# Altium schematic sheet EP2C5T144C8.SchDoc
size A3
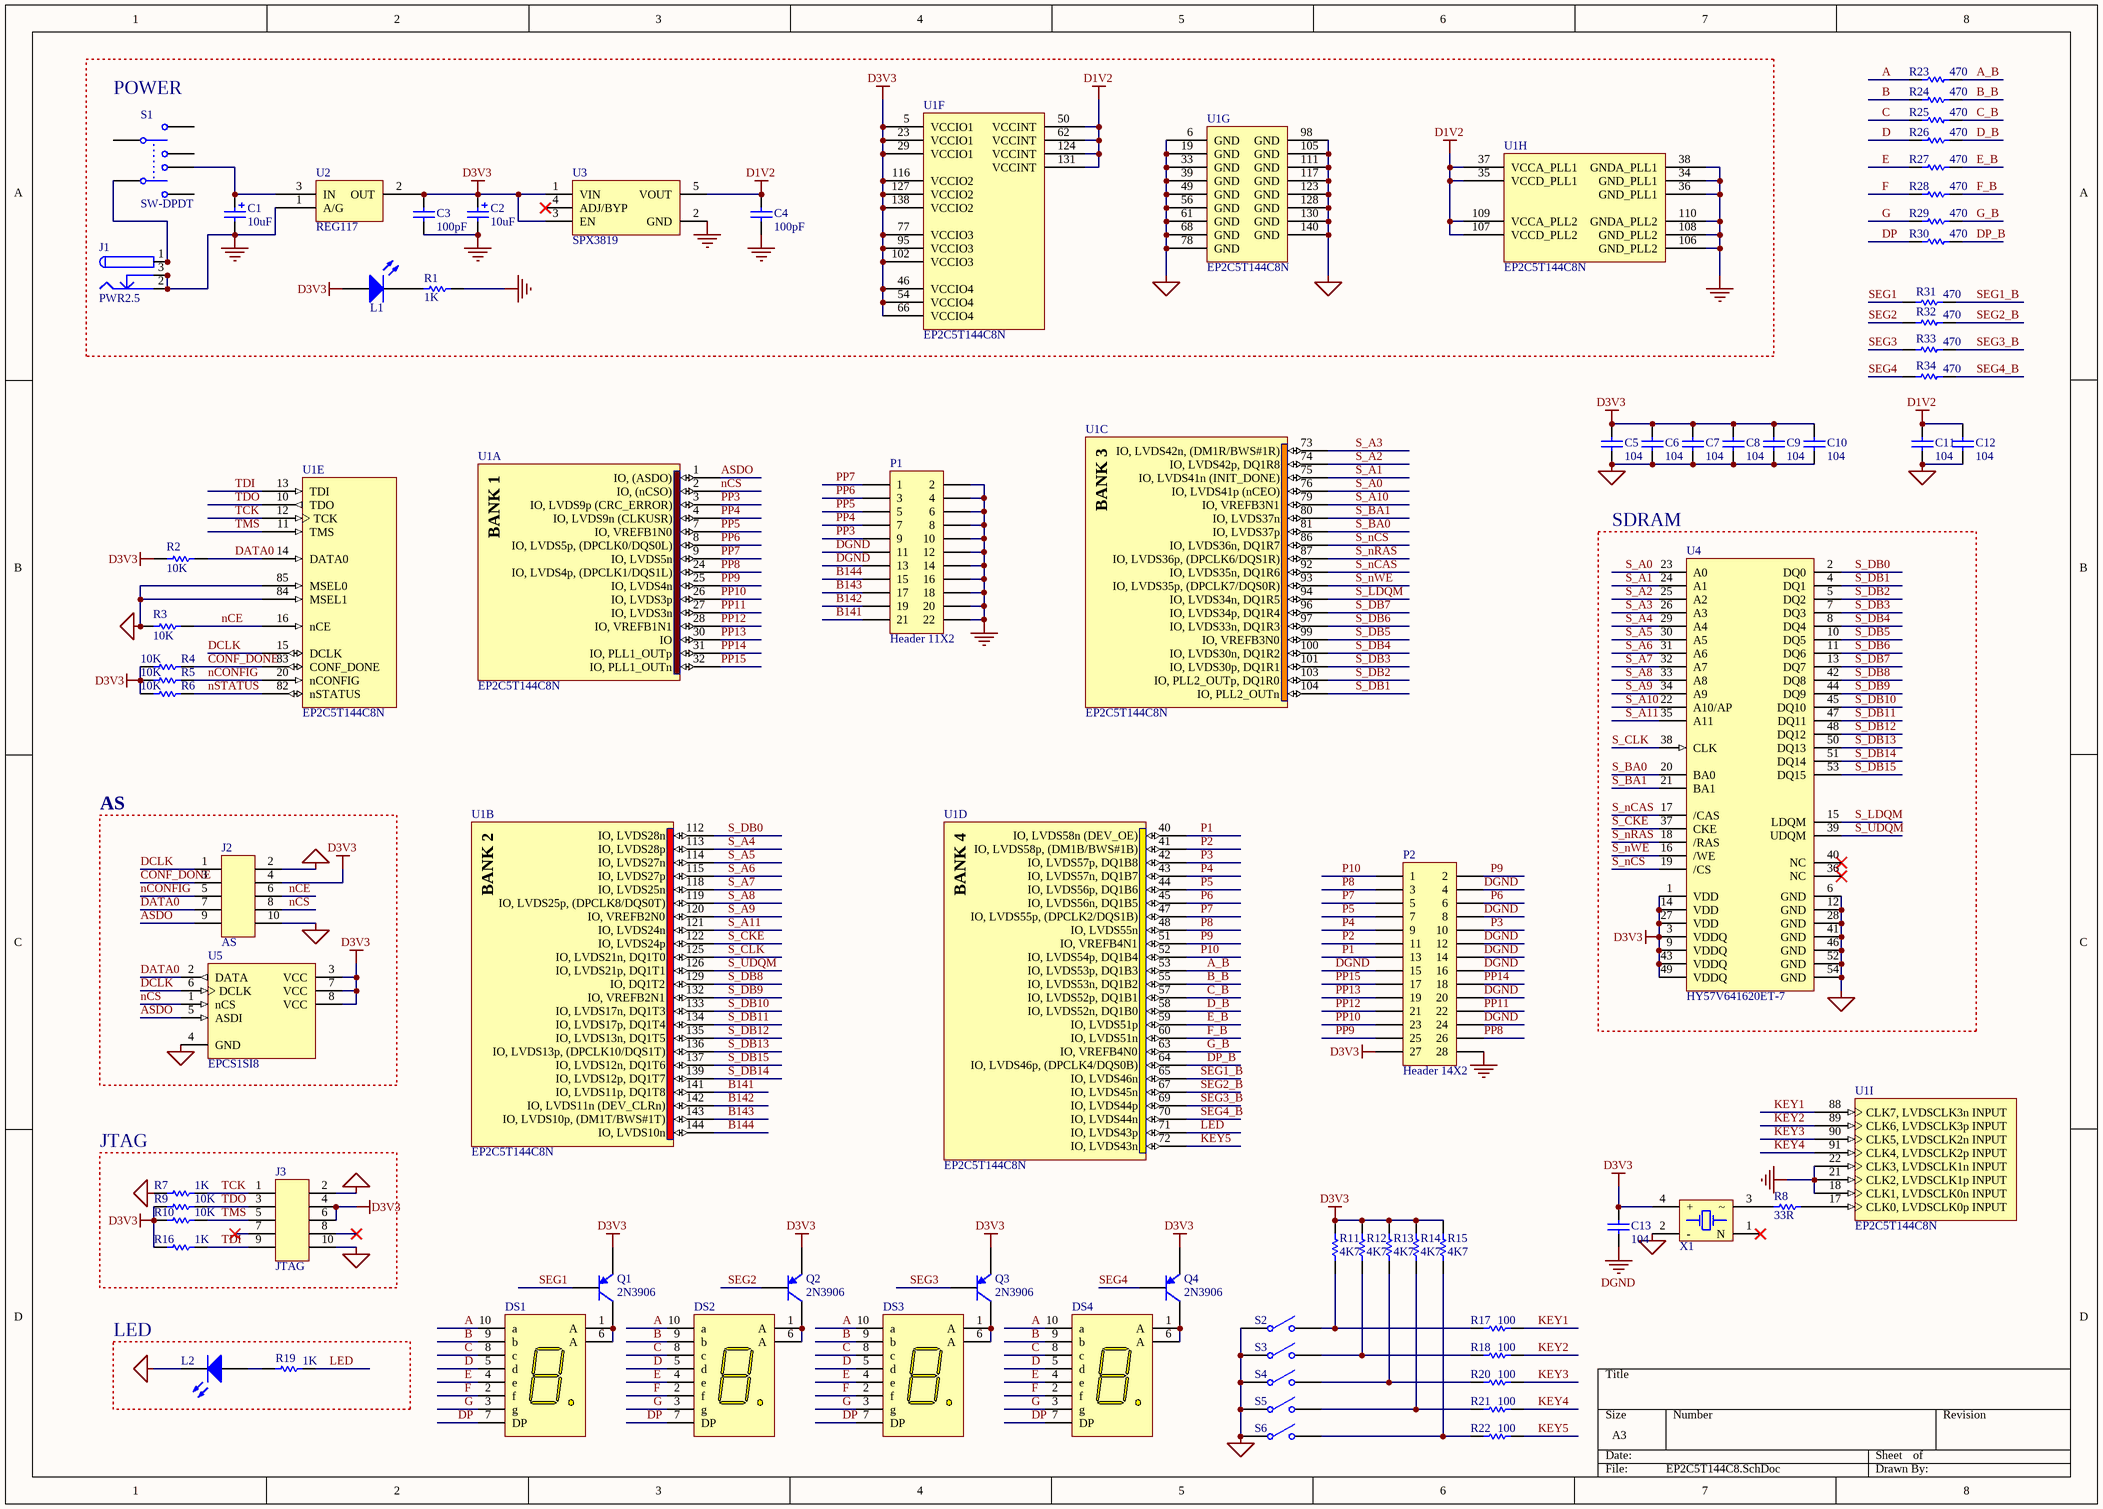
[diagram p0: EP2C5T144C8.SchDoc]

## Parts
C1  value 10uF  [tanCap]  (hidden comment: Cap Pol3)
C2  value 10uF  [tanCap]  (hidden comment: Cap Pol3)
C3  value 100pF  [CC2012-0805]  (hidden comment: Cap Semi)
C4  value 100pF  [CC2012-0805]  (hidden comment: Cap Semi)
C5  value 104  [CC2012-0805]  (hidden comment: Cap Semi)
C6  value 104  [CC2012-0805]  (hidden comment: Cap Semi)
C7  value 104  [CC2012-0805]  (hidden comment: Cap Semi)
C8  value 104  [CC2012-0805]  (hidden comment: Cap Semi)
C9  value 104  [CC2012-0805]  (hidden comment: Cap Semi)
C10  value 104  [CC2012-0805]  (hidden comment: Cap Semi)
C11  value 104  [CC2012-0805]  (hidden comment: Cap Semi)
C12  value 104  [CC2012-0805]  (hidden comment: Cap Semi)
C13  value 104  [CC2012-0805]  (hidden comment: Cap)
DS1  Dpy Yellow-CA  [LEDDIP-10]  (value not drawn)
DS2  Dpy Yellow-CA  [LEDDIP-10]  (value not drawn)
DS3  Dpy Yellow-CA  [LEDDIP-10]  (value not drawn)
DS4  Dpy Yellow-CA  [LEDDIP-10]  (value not drawn)
J1  PWR2.5  [KLD-0202]
J2  AS  [JATG_XU]
J3  JTAG  [JATG_XU]
L1  LED-3MM  [CC2012-0805]  (value not drawn)
L2  LED-3MM  [CC2012-0805]  (value not drawn)
P1  Header 11X2  [HDR2X11]
P2  Header 14X2  [HDR2X14]
Q1  2N3906  [SOT-23]
Q2  2N3906  [SOT-23]
Q3  2N3906  [SOT-23]
Q4  2N3906  [SOT-23]
R1  value 1K  [CR2012-0805]  (hidden comment: Res1)
R2  value 10K  [CR2012-0805]  (hidden comment: Res Semi)
R3  value 10K  [CR2012-0805]  (hidden comment: Res1)
R4  value 10K  [CR2012-0805]  (hidden comment: Res1)
R5  value 10K  [CR2012-0805]  (hidden comment: Res1)
R6  value 10K  [CR2012-0805]  (hidden comment: Res1)
R7  value 1K  [CR2012-0805]  (hidden comment: Res1)
R8  value 33R  [CR2012-0805]  (hidden comment: Res1)
R9  value 10K  [CR2012-0805]  (hidden comment: Res1)
R10  value 10K  [CR2012-0805]  (hidden comment: Res1)
R11  value 4K7  [CR2012-0805]  (hidden comment: Res1)
R12  value 4K7  [CR2012-0805]  (hidden comment: Res1)
R13  value 4K7  [CR2012-0805]  (hidden comment: Res1)
R14  value 4K7  [CR2012-0805]  (hidden comment: Res1)
R15  value 4K7  [CR2012-0805]  (hidden comment: Res1)
R16  value 1K  [CR2012-0805]  (hidden comment: Res1)
R17  value 100  [CR2012-0805]  (hidden comment: Res1)
R18  value 100  [CR2012-0805]  (hidden comment: Res1)
R19  value 1K  [CR2012-0805]  (hidden comment: Res1)
R20  value 100  [CR2012-0805]  (hidden comment: Res1)
R21  value 100  [CR2012-0805]  (hidden comment: Res1)
R22  value 100  [CR2012-0805]  (hidden comment: Res1)
R23  value 470  [CR2012-0805]  (hidden comment: Res1)
R24  value 470  [CR2012-0805]  (hidden comment: Res1)
R25  value 470  [CR2012-0805]  (hidden comment: Res1)
R26  value 470  [CR2012-0805]  (hidden comment: Res1)
R27  value 470  [CR2012-0805]  (hidden comment: Res1)
R28  value 470  [CR2012-0805]  (hidden comment: Res1)
R29  value 470  [CR2012-0805]  (hidden comment: Res1)
R30  value 470  [CR2012-0805]  (hidden comment: Res1)
R31  value 470  [CR2012-0805]  (hidden comment: Res1)
R32  value 470  [CR2012-0805]  (hidden comment: Res1)
R33  value 470  [CR2012-0805]  (hidden comment: Res1)
R34  value 470  [CR2012-0805]  (hidden comment: Res1)
S1  SW-DPDT  [DPDT-6]
S2  SW-SPST  [SW2]  (value not drawn)
S3  SW-SPST  [SW2]  (value not drawn)
S4  SW-SPST  [SW2]  (value not drawn)
S5  SW-SPST  [SW2]  (value not drawn)
S6  SW-SPST  [SW2]  (value not drawn)
U1  EP2C5T144C8N  [TQFP144_N]  (parts A,B,C,D,E,F,G,H,I of 9)
U2  REG117  [SOT223]
U3  SPX3819  [SO-G5/P.95]
U4  HY57V641620ET-7  [TSOP-54]
U5  EPCS1SI8  [SOIC8]
X1  XTAL-S  [DSO-N4]  (value not drawn)

## Blocks framed on the sheet
POWER: C1-C4 J1 L1 R1 S1 U1-U3
SDRAM: U4
AS: J2 U5
JTAG: J3 R7 R9 R10 R16
LED: L2 R19

## Nets
D1V2: C4.2 C11.2 C12.2 U1.35(VCCD_PLL1) U1.37(VCCA_PLL1) U1.50(VCCINT) U1.62(VCCINT) U1.107(VCCD_PLL2) U1.109(VCCA_PLL2) U1.124(VCCINT) U1.131(VCCINT) U3.5(VOUT)
D3V3: C2.1 C3.2 C5.2 C6.2 C7.2 C8.2 C9.2 C10.2 C13.2 J2.4 J3.4 J3.6 L1.1(A) P2.27 Q1.1(E) Q2.1(E) Q3.1(E) Q4.1(E) R2.2 R4.2 R5.2 R6.2 R9.2 R10.2 R11.1 R12.1 R13.1 R14.1 R15.1 R16.2 U1.5(VCCIO1) U1.23(VCCIO1) U1.29(VCCIO1) U1.46(VCCIO4) U1.54(VCCIO4) U1.66(VCCIO4) U1.77(VCCIO3) U1.95(VCCIO3) U1.102(VCCIO3) U1.116(VCCIO2) U1.127(VCCIO2) U1.138(VCCIO2) U2.2(OUT) U3.1(VIN) U3.3(EN) U4.1(VDD) U4.3(VDDQ) U4.9(VDDQ) U4.14(VDD) U4.27(VDD) U4.43(VDDQ) U4.49(VDDQ) U5.3(VCC) U5.7(VCC) U5.8(VCC) X1.4(+)
DGND: C1.2 C2.2 C3.1 C4.1 C5.1 C6.1 C7.1 C8.1 C9.1 C10.1 C11.1 C12.1 C13.1 J1.2 J1.2A J1.2B J1.3 J1.3A J1.3B J2.2 J2.10 J3.2 J3.10 L2.2(K) P1.2 P1.4 P1.6 P1.8 P1.10 P1.11 P1.12 P1.13 P1.14 P1.16 P1.18 P1.20 P1.22 P2.4 P2.8 P2.12 P2.14 P2.15 P2.16 P2.20 P2.24 P2.28 R1.1 R3.2 R7.2 S2.1(COMMON) S3.1(COMMON) S4.1(COMMON) S5.1(COMMON) S6.1(COMMON) U1.6(GND) U1.18(CLK1,_LVDSCLK0n_INPUT) U1.19(GND) U1.21(CLK2,_LVDSCLK1p_INPUT) U1.22(CLK3,_LVDSCLK1n_INPUT) U1.33(GND) U1.34(GND_PLL1) U1.36(GND_PLL1) U1.38(GNDA_PLL1) U1.39(GND) U1.49(GND) U1.56(GND) U1.61(GND) U1.68(GND) U1.78(GND) U1.84(MSEL1) U1.85(MSEL0) U1.98(GND) U1.105(GND) U1.106(GND_PLL2) U1.108(GND_PLL2) U1.110(GNDA_PLL2) U1.111(GND) U1.117(GND) U1.123(GND) U1.128(GND) U1.130(GND) U1.140(GND) U2.1(A/G) U3.2(GND) U4.6(GND) U4.12(GND) U4.28(GND) U4.41(GND) U4.46(GND) U4.52(GND) U4.54(GND) U5.4(GND) X1.2(-)
A: DS1.10(a) DS2.10(a) DS3.10(a) DS4.10(a) R23.2
A_B: R23.1 U1.53(IO,_LVDS53p,_DQ1B3)
ASDO: J2.9 U1.1(IO,_(ASDO)) U5.5(ASDI)
B: DS1.9(b) DS2.9(b) DS3.9(b) DS4.9(b) R24.2
B141: P1.21 U1.141(IO,_LVDS11p,_DQ1T8)
B142: P1.19 U1.142(IO,_LVDS11n_(DEV_CLRn))
B143: P1.17 U1.143(IO,_LVDS10p,_(DM1T/BWS#1T))
B144: P1.15 U1.144(IO,_LVDS10n)
B_B: R24.1 U1.55(IO,_LVDS53n,_DQ1B2)
C: DS1.8(c) DS2.8(c) DS3.8(c) DS4.8(c) R25.2
C_B: R25.1 U1.57(IO,_LVDS52p,_DQ1B1)
CONF_DONE: J2.3 R4.1 U1.83(CONF_DONE)
D: DS1.5(d) DS2.5(d) DS3.5(d) DS4.5(d) R26.2
D_B: R26.1 U1.58(IO,_LVDS52n,_DQ1B0)
DATA0: J2.7 R2.1 U1.14(DATA0) U5.2(DATA)
DCLK: J2.1 U1.15(DCLK) U5.6(DCLK)
DP: DS1.7(DP) DS2.7(DP) DS3.7(DP) DS4.7(DP) R30.2
DP_B: R30.1 U1.64(IO,_LVDS46p,_(DPCLK4/DQS0B))
E: DS1.4(e) DS2.4(e) DS3.4(e) DS4.4(e) R27.2
E_B: R27.1 U1.59(IO,_LVDS51p)
F: DS1.2(f) DS2.2(f) DS3.2(f) DS4.2(f) R28.2
F_B: R28.1 U1.60(IO,_LVDS51n)
G: DS1.3(g) DS2.3(g) DS3.3(g) DS4.3(g) R29.2
G_B: R29.1 U1.63(IO,_VREFB4N0)
KEY1: R17.1 U1.88(CLK7,_LVDSCLK3n_INPUT)
KEY2: R18.1 U1.89(CLK6,_LVDSCLK3p_INPUT)
KEY3: R20.1 U1.90(CLK5,_LVDSCLK2n_INPUT)
KEY4: R21.1 U1.91(CLK4,_LVDSCLK2p_INPUT)
KEY5: R22.1 U1.72(IO,_LVDS43n)
LED: R19.1 U1.71(IO,_LVDS43p)
nCE: J2.6 R3.1 U1.16(nCE)
nCONFIG: J2.5 R5.1 U1.20(nCONFIG)
nCS: J2.8 U1.2(IO,_(nCSO)) U5.1(nCS)
nSTATUS: R6.1 U1.82(nSTATUS)
P1: P2.13 U1.40(IO,_LVDS58n_(DEV_OE))
P2: P2.11 U1.41(IO,_LVDS58p,_(DM1B/BWS#1B))
P3: P2.10 U1.42(IO,_LVDS57p,_DQ1B8)
P4: P2.9 U1.43(IO,_LVDS57n,_DQ1B7)
P5: P2.7 U1.44(IO,_LVDS56p,_DQ1B6)
P6: P2.6 U1.45(IO,_LVDS56n,_DQ1B5)
P7: P2.5 U1.47(IO,_LVDS55p,_(DPCLK2/DQS1B))
P8: P2.3 U1.48(IO,_LVDS55n)
P9: P2.2 U1.51(IO,_VREFB4N1)
P10: P2.1 U1.52(IO,_LVDS54p,_DQ1B4)
PP3: P1.9 U1.3(IO,_LVDS9p_(CRC_ERROR))
PP4: P1.7 U1.4(IO,_LVDS9n_(CLKUSR))
PP5: P1.5 U1.7(IO,_VREFB1N0)
PP6: P1.3 U1.8(IO,_LVDS5p,_(DPCLK0/DQS0L))
PP7: P1.1 U1.9(IO,_LVDS5n)
PP8: P2.26 U1.24(IO,_LVDS4p,_(DPCLK1/DQS1L))
PP9: P2.25 U1.25(IO,_LVDS4n)
PP10: P2.23 U1.26(IO,_LVDS3p)
PP11: P2.22 U1.27(IO,_LVDS3n)
PP12: P2.21 U1.28(IO,_VREFB1N1)
PP13: P2.19 U1.30(IO)
PP14: P2.18 U1.31(IO,_PLL1_OUTp)
PP15: P2.17 U1.32(IO,_PLL1_OUTn)
S_A0: U1.76(IO,_LVDS41p_(nCEO)) U4.23(A0)
S_A1: U1.75(IO,_LVDS41n_(INIT_DONE)) U4.24(A1)
S_A2: U1.74(IO,_LVDS42p,_DQ1R8) U4.25(A2)
S_A3: U1.73(IO,_LVDS42n,_(DM1R/BWS#1R)) U4.26(A3)
S_A4: U1.113(IO,_LVDS28p) U4.29(A4)
S_A5: U1.114(IO,_LVDS27n) U4.30(A5)
S_A6: U1.115(IO,_LVDS27p) U4.31(A6)
S_A7: U1.118(IO,_LVDS25n) U4.32(A7)
S_A8: U1.119(IO,_LVDS25p,_(DPCLK8/DQS0T)) U4.33(A8)
S_A9: U1.120(IO,_VREFB2N0) U4.34(A9)
S_A10: U1.79(IO,_VREFB3N1) U4.22(A10/AP)
S_A11: U1.121(IO,_LVDS24n) U4.35(A11)
S_BA0: U1.81(IO,_LVDS37p) U4.20(BA0)
S_BA1: U1.80(IO,_LVDS37n) U4.21(BA1)
S_CKE: U1.122(IO,_LVDS24p) U4.37(CKE)
S_CLK: U1.125(IO,_LVDS21n,_DQ1T0) U4.38(CLK)
S_DB0: U1.112(IO,_LVDS28n) U4.2(DQ0)
S_DB1: U1.104(IO,_PLL2_OUTn) U4.4(DQ1)
S_DB2: U1.103(IO,_PLL2_OUTp,_DQ1R0) U4.5(DQ2)
S_DB3: U1.101(IO,_LVDS30p,_DQ1R1) U4.7(DQ3)
S_DB4: U1.100(IO,_LVDS30n,_DQ1R2) U4.8(DQ4)
S_DB5: U1.99(IO,_VREFB3N0) U4.10(DQ5)
S_DB6: U1.97(IO,_LVDS33n,_DQ1R3) U4.11(DQ6)
S_DB7: U1.96(IO,_LVDS34p,_DQ1R4) U4.13(DQ7)
S_DB8: U1.129(IO,_DQ1T2) U4.42(DQ8)
S_DB9: U1.132(IO,_VREFB2N1) U4.44(DQ9)
S_DB10: U1.133(IO,_LVDS17n,_DQ1T3) U4.45(DQ10)
S_DB11: U1.134(IO,_LVDS17p,_DQ1T4) U4.47(DQ11)
S_DB12: U1.135(IO,_LVDS13n,_DQ1T5) U4.48(DQ12)
S_DB13: U1.136(IO,_LVDS13p,_(DPCLK10/DQS1T)) U4.50(DQ13)
S_DB14: U1.139(IO,_LVDS12p,_DQ1T7) U4.51(DQ14)
S_DB15: U1.137(IO,_LVDS12n,_DQ1T6) U4.53(DQ15)
S_LDQM: U1.94(IO,_LVDS34n,_DQ1R5) U4.15(LDQM)
S_nCAS: U1.92(IO,_LVDS35n,_DQ1R6) U4.17(/CAS)
S_nCS: U1.86(IO,_LVDS36n,_DQ1R7) U4.19(/CS)
S_nRAS: U1.87(IO,_LVDS36p,_(DPCLK6/DQS1R)) U4.18(/RAS)
S_nWE: U1.93(IO,_LVDS35p,_(DPCLK7/DQS0R)) U4.16(/WE)
S_UDQM: U1.126(IO,_LVDS21p,_DQ1T1) U4.39(UDQM)
SEG1: Q1.2(B) R31.2
SEG1_B: R31.1 U1.65(IO,_LVDS46n)
SEG2: Q2.2(B) R32.2
SEG2_B: R32.1 U1.67(IO,_LVDS45n)
SEG3: Q3.2(B) R33.2
SEG3_B: R33.1 U1.69(IO,_LVDS44p)
SEG4: Q4.2(B) R34.2
SEG4_B: R34.1 U1.70(IO,_LVDS44n)
TCK: J3.1 R7.1 U1.12(TCK)
TDI: J3.9 R16.1 U1.13(TDI)
TDO: J3.3 R9.1 U1.10(TDO)
TMS: J3.5 R10.1 U1.11(TMS)
NetC1_1: C1.1 S1.5 U2.3(IN)
NetDS1_1: DS1.1(A) DS1.6(A) Q1.3(C)
NetDS2_1: DS2.1(A) DS2.6(A) Q2.3(C)
NetDS3_1: DS3.1(A) DS3.6(A) Q3.3(C)
NetDS4_1: DS4.1(A) DS4.6(A) Q4.3(C)
NetJ1_1: J1.1 J1.1A J1.1B S1.4
NetL1_2: L1.2(K) R1.2
NetL2_1: L2.1(A) R19.2
NetR8_1: R8.1 U1.17(CLK0,_LVDSCLK0p_INPUT)
NetR8_2: R8.2 X1.3
NetR11_2: R11.2 R17.2 S2.2(NO)
NetR12_2: R12.2 R18.2 S3.2(NO)
NetR13_2: R13.2 R20.2 S4.2(NO)
NetR14_2: R14.2 R21.2 S5.2(NO)
NetR15_2: R15.2 R22.2 S6.2(NO)

Not connected (* = marked no-connect by the designer): J3 7* 8*; S1 1 2 3 6; U3 4(ADJ/BYP)*; U4 36(NC)* 40(NC)*; X1 1(N)*

## Notes on the sheet
- (in symbol EP2C5T144C8N, part A) BANK 1
- (in symbol EP2C5T144C8N, part B) BANK 2
- (in symbol EP2C5T144C8N, part C) BANK 3
- (in symbol EP2C5T144C8N, part D) BANK 4

## Library data of the parts
C1 C2 = Cap Pol3: Polarized Capacitor (Surface Mount); Published: 8-Jun-2000; Revision: July-2002: Re-released for DXP Platform.; Publisher: Altium Limited
C3-C12 = Cap Semi: Capacitor (Semiconductor SIM Model); Published: 8-Jun-2000; Revision: July-2002: Re-released for DXP Platform.; Publisher: Altium Limited
C13 = Cap: Capacitor; Published: 8-Jun-2000; Revision: July-2002: Re-released for DXP Platform.; Publisher: Altium Limited
DS1-DS4 = Dpy Yellow-CA: 7.6 mm Micro Bright Yellow 7-Segment Display: CA, RH DP; MinimumIntensity: 225 ucd; Note: IF = 5 mA; Note: Pins 1 and 6 are redundant Anodes.; Published: 8-Jun-2000; LatestRevisionDate: 17-Dec-2003; LatestRevisionNote: Schematic revised, PCB Footprint replaced.; DatasheetDocument: 11-Feb-2002; PackageDocument: 19-Feb-2002; PackageReference: LEDDIP-10; Publisher: Altium Limited; Colour: Yellow; ComponentLink1Description: Manufacturer Link; ComponentLink1URL: http://www.agilent.com/
J1 = PWR2.5: Low Voltage Power Supply Connector; Published: 17-Dec-2003; DatasheetDocument: 09-May-2002; Publisher: Altium Limited; ComponentLink1Description: Manufacturer Link; ComponentLink1URL: http://domino.kycon.com/internet/Products.html
J2 J3 = JTAG_XU
P1 = Header 11X2: Header, 11-Pin, Dual row; LatestRevisionDate: 17-Jul-2002; LatestRevisionNote: Re-released for DXP Platform.; Publisher: Altium Limited
P2 = Header 14X2: Header, 14-Pin, Dual row; LatestRevisionDate: 17-Jul-2002; LatestRevisionNote: Re-released for DXP Platform.; Publisher: Altium Limited
Q1-Q4 = 2N3906: PNP General Purpose Amplifier; Published: 8-Jun-2000; LatestRevisionDate: 15-Jan-2003; LatestRevisionNote: PCB Footprint 'BCY-W3/D4.7' replaced; DatasheetDocument: 1997; PackageDocument: Sep-1998; PackageReference: TO-92A; Publisher: Altium Limited; Code_JEDEC: TO-92A; ComponentLink1Description: Manufacturer Link; ComponentLink1URL: http://www.fairchildsemi.com/; ComponentLink2Description: Datasheet; ComponentLink2URL: http://www.fairchildsemi.com/ds/2N%2F2N3906.pdf
R1 R3-R34 = Res1: Resistor; Published: 8-Jun-2000; Revision: July-2002: Re-released for DXP Platform.; Publisher: Altium Limited
R2 = Res Semi: Semiconductor Resistor; Published: 8-Jun-2000; LatestRevisionDate: 17-Jul-2002; LatestRevisionNote: Re-released for DXP Platform.; PackageReference: AXIAL-0.5; Publisher: Altium Limited
S1 = SW-DPDT: Double-Pole, Double-Throw Switch; Published: 24-Mar-1999; LatestRevisionDate: 17-Jul-2002; LatestRevisionNote: Re-released for DXP Platform.; PackageReference: DPDT-6; Publisher: Altium Limited
S2-S6 = SW-SPST: Single-Pole, Single-Throw Switch; Published: 24-Mar-1999; LatestRevisionDate: 17-Jul-2002; LatestRevisionNote: Re-released for DXP Platform.; PackageReference: SPST-2; Publisher: Altium Limited
U1 = EP2C5T144C8N: Cyclone II Family, 1.2V FPGA, 89 I/O Pins, 2 PLLs, 144-Pin TQFP, Speed Grade 8, Commercial Grade, Pb-Free; Published: 4-Mar-2005; LatestRevisionDate: 14-May-2007; LatestRevisionNote: DATA0 pin is now INPUT.; DatasheetVersion: ver3.2, Apr-2007; PackageVersion: ver14.6, Feb-2007; PackageReference: TQFP144; Publisher: Altium Limited; PackageDescription: 144-Pin Plastic Thin Quad Flat Pack (TQFP144) - Wire Bond; Code_JEDEC: MS-026-BFB; ComponentLink1Description: Manufacturer Link; ComponentLink1URL: http://www.altera.com/products/devices/cyclone2/cy2-index.jsp; ComponentLink2Description: Handbook; ComponentLink2URL: http://www.altera.com/literature/hb/cyc2/cyc2_cii5v1.pdf; ComponentLink3Description: Packaging Specification; ComponentLink3URL: http://www.altera.com/literature/ds/dspkg.pdf
U5 = EPCS1SI8: EPCS1 Series, In-system programmable 3.3V configuration device, 8-Pin SOIC, 1-Megabit, Industrial Grade; Package Information: Latest Revision: ver11.0, Feb-2003; Serially configures: Cyclone FPGAs; Code - JEDEC: MS-012-AA; Code - IPC: SO8; Published: 17-Sep-2003; Datasheet: Latest Revision: ver1.1, Oct-2003; Package Reference: SOIC8; Publisher: Altium Limited